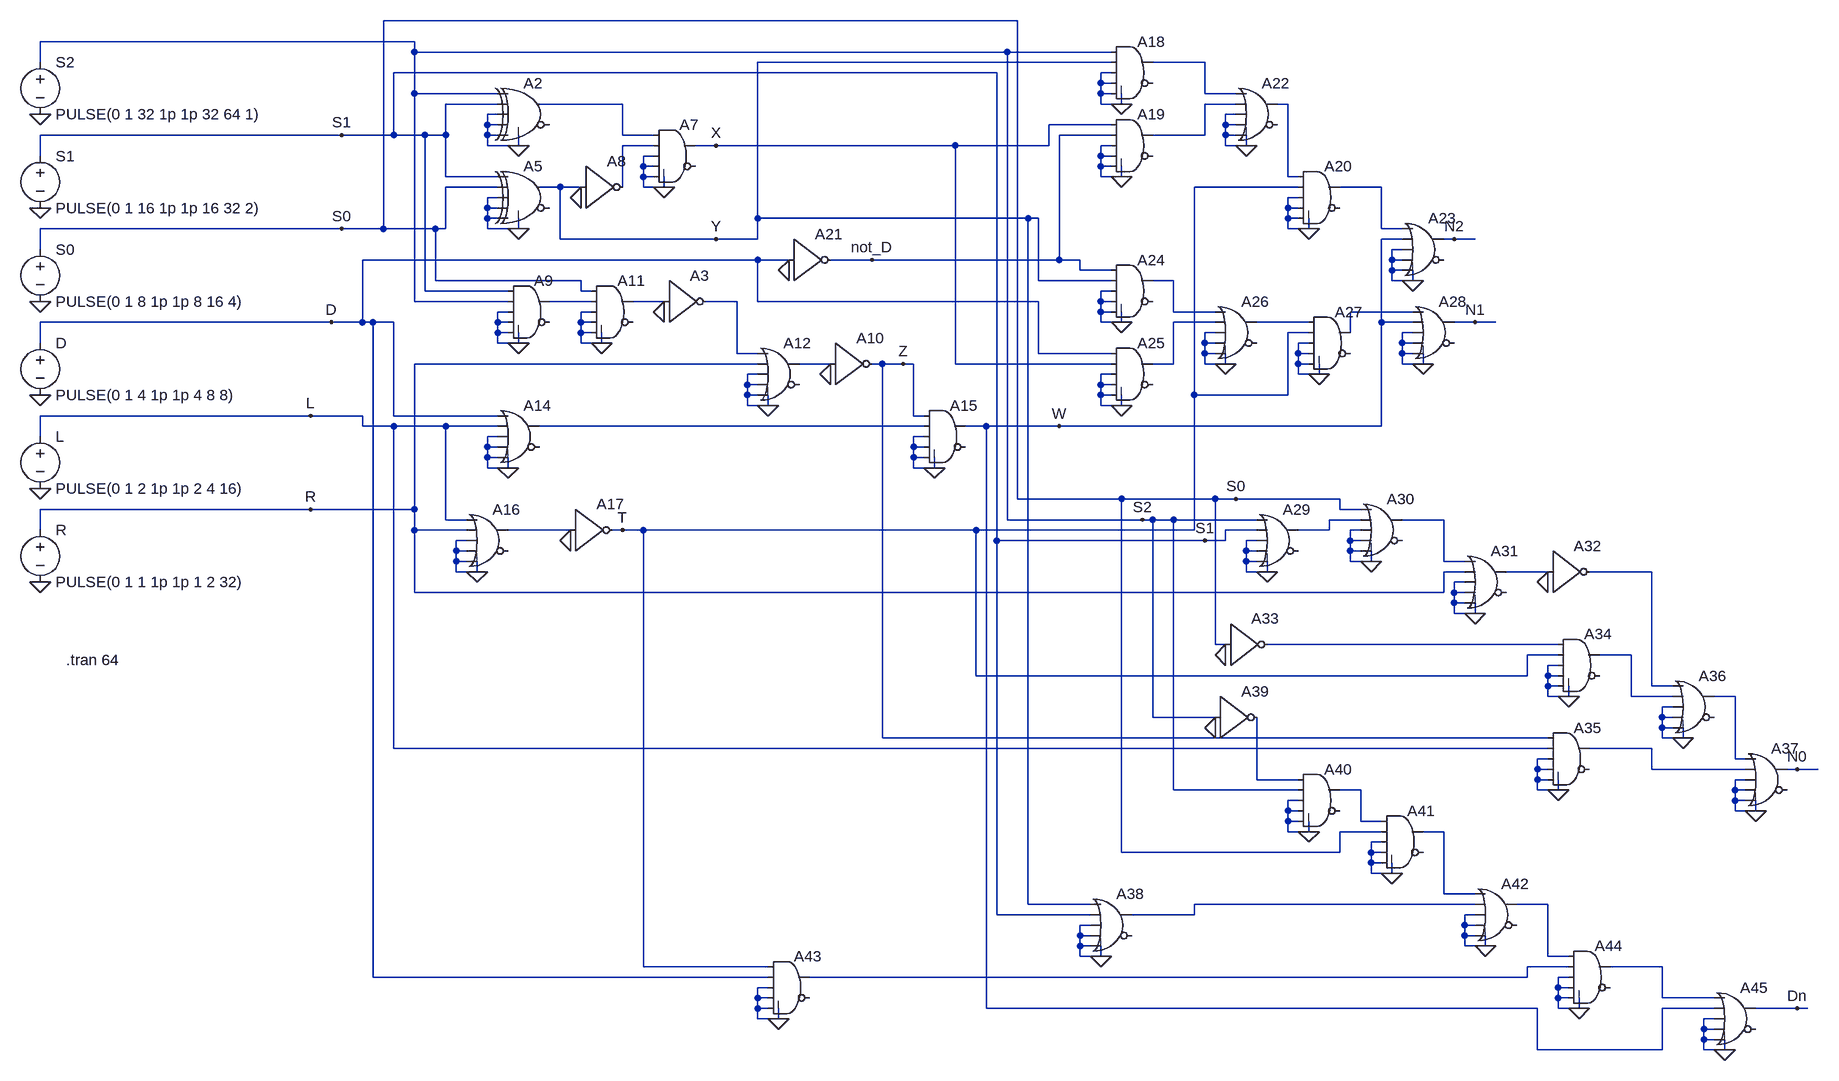
[diagram p0: schematic lab3_spice.asc]
lab3_spice.asc, the LTspice schematic file:
Version 4.1
SHEET 1 2180 1396
WIRE 944 -208 -32 -208
WIRE 16 -176 -560 -176
WIRE 16 -160 16 -176
WIRE 928 -160 16 -160
WIRE 1088 -160 928 -160
WIRE -560 -144 -560 -176
WIRE 1088 -144 544 -144
WIRE 1232 -144 1152 -144
WIRE 912 -128 -16 -128
WIRE 1088 -128 1072 -128
WIRE 1072 -112 1072 -128
WIRE 1088 -112 1072 -112
WIRE 16 -96 16 -160
WIRE 144 -96 16 -96
WIRE 1072 -96 1072 -112
WIRE 1088 -96 1072 -96
WIRE 1232 -96 1232 -144
WIRE 1280 -96 1232 -96
WIRE 144 -80 64 -80
WIRE 336 -80 208 -80
WIRE 1072 -80 1072 -96
WIRE 1104 -80 1104 -96
WIRE 1104 -80 1072 -80
WIRE 1280 -80 1232 -80
WIRE 1360 -80 1344 -80
WIRE 144 -64 128 -64
WIRE 1280 -64 1264 -64
WIRE 128 -48 128 -64
WIRE 144 -48 128 -48
WIRE 1088 -48 992 -48
WIRE 1264 -48 1264 -64
WIRE 1280 -48 1264 -48
WIRE -96 -32 -560 -32
WIRE -16 -32 -16 -128
WIRE -16 -32 -96 -32
WIRE 32 -32 -16 -32
WIRE 64 -32 64 -80
WIRE 64 -32 32 -32
WIRE 128 -32 128 -48
WIRE 144 -32 128 -32
WIRE 336 -32 336 -80
WIRE 384 -32 336 -32
WIRE 1088 -32 1008 -32
WIRE 1232 -32 1232 -80
WIRE 1232 -32 1152 -32
WIRE 1264 -32 1264 -48
WIRE 1280 -32 1264 -32
WIRE 128 -16 128 -32
WIRE 176 -16 176 -32
WIRE 176 -16 128 -16
WIRE 384 -16 336 -16
WIRE 480 -16 448 -16
WIRE 848 -16 480 -16
WIRE 992 -16 992 -48
WIRE 992 -16 848 -16
WIRE 1088 -16 1072 -16
WIRE 1264 -16 1264 -32
WIRE 1296 -16 1296 -32
WIRE 1296 -16 1264 -16
WIRE -560 0 -560 -32
WIRE 384 0 368 0
WIRE 1072 0 1072 -16
WIRE 1088 0 1072 0
WIRE 368 16 368 0
WIRE 384 16 368 16
WIRE 1072 16 1072 0
WIRE 1088 16 1072 16
WIRE 64 32 64 -32
WIRE 144 32 64 32
WIRE 368 32 368 16
WIRE 384 32 368 32
WIRE 1072 32 1072 16
WIRE 1104 32 1104 16
WIRE 1104 32 1072 32
WIRE 1360 32 1360 -80
WIRE 1376 32 1360 32
WIRE 144 48 64 48
WIRE 240 48 208 48
WIRE 272 48 240 48
WIRE 336 48 336 -16
WIRE 368 48 368 32
WIRE 400 48 400 32
WIRE 400 48 368 48
WIRE 1376 48 1216 48
WIRE 1504 48 1440 48
WIRE 144 64 128 64
WIRE 1376 64 1360 64
WIRE 128 80 128 64
WIRE 144 80 128 80
WIRE 1360 80 1360 64
WIRE 1376 80 1360 80
WIRE 128 96 128 80
WIRE 144 96 128 96
WIRE 544 96 544 -144
WIRE 960 96 544 96
WIRE 976 96 960 96
WIRE 1360 96 1360 80
WIRE 1376 96 1360 96
WIRE -96 112 -560 112
WIRE -32 112 -32 -208
WIRE -32 112 -96 112
WIRE 48 112 -32 112
WIRE 64 112 64 48
WIRE 64 112 48 112
WIRE 128 112 128 96
WIRE 176 112 176 96
WIRE 176 112 128 112
WIRE 1360 112 1360 96
WIRE 1392 112 1392 96
WIRE 1392 112 1360 112
WIRE 1504 112 1504 48
WIRE 1536 112 1504 112
WIRE 240 128 240 48
WIRE 480 128 240 128
WIRE 544 128 544 96
WIRE 544 128 480 128
WIRE 1536 128 1504 128
WIRE 1616 128 1600 128
WIRE 1648 128 1616 128
WIRE -560 144 -560 112
WIRE 1536 144 1520 144
WIRE 544 160 -64 160
WIRE 592 160 544 160
WIRE 720 160 656 160
WIRE 1008 160 1008 -32
WIRE 1008 160 720 160
WIRE 1040 160 1008 160
WIRE 1520 160 1520 144
WIRE 1536 160 1520 160
WIRE 1040 176 1040 160
WIRE 1088 176 1040 176
WIRE 1520 176 1520 160
WIRE 1536 176 1520 176
WIRE 48 192 48 112
WIRE 272 192 48 192
WIRE 976 192 976 96
WIRE 1088 192 976 192
WIRE 1184 192 1152 192
WIRE 1520 192 1520 176
WIRE 1552 192 1552 176
WIRE 1552 192 1520 192
WIRE 32 208 32 -32
WIRE 160 208 32 208
WIRE 272 208 272 192
WIRE 288 208 272 208
WIRE 1088 208 1072 208
WIRE 16 224 16 -96
WIRE 160 224 16 224
WIRE 288 224 224 224
WIRE 400 224 352 224
WIRE 512 224 464 224
WIRE 544 224 544 160
WIRE 976 224 544 224
WIRE 1072 224 1072 208
WIRE 1088 224 1072 224
WIRE 160 240 144 240
WIRE 288 240 272 240
WIRE 1072 240 1072 224
WIRE 1088 240 1072 240
WIRE 1184 240 1184 192
WIRE 1248 240 1184 240
WIRE 1552 240 1456 240
WIRE -112 256 -560 256
WIRE -64 256 -64 160
WIRE -64 256 -112 256
WIRE -48 256 -64 256
WIRE -16 256 -48 256
WIRE 144 256 144 240
WIRE 160 256 144 256
WIRE 272 256 272 240
WIRE 288 256 272 256
WIRE 1072 256 1072 240
WIRE 1104 256 1104 240
WIRE 1104 256 1072 256
WIRE 1248 256 1184 256
WIRE 1392 256 1312 256
WIRE 1504 256 1504 128
WIRE 1552 256 1504 256
WIRE 1648 256 1616 256
WIRE 1680 256 1648 256
WIRE 144 272 144 256
WIRE 160 272 144 272
WIRE 272 272 272 256
WIRE 288 272 272 272
WIRE 1248 272 1232 272
WIRE 1392 272 1360 272
WIRE 1456 272 1456 240
WIRE 1552 272 1536 272
WIRE -560 288 -560 256
WIRE 144 288 144 272
WIRE 176 288 176 272
WIRE 176 288 144 288
WIRE 272 288 272 272
WIRE 304 288 304 272
WIRE 304 288 272 288
WIRE 1232 288 1232 272
WIRE 1248 288 1232 288
WIRE 1392 288 1376 288
WIRE 1536 288 1536 272
WIRE 1552 288 1536 288
WIRE 512 304 512 224
WIRE 544 304 512 304
WIRE 976 304 976 224
WIRE 1088 304 976 304
WIRE 1232 304 1232 288
WIRE 1248 304 1232 304
WIRE 1376 304 1376 288
WIRE 1392 304 1376 304
WIRE 1536 304 1536 288
WIRE 1552 304 1536 304
WIRE 544 320 16 320
WIRE 656 320 608 320
WIRE 736 320 720 320
WIRE 768 320 736 320
WIRE 784 320 768 320
WIRE 848 320 848 -16
WIRE 1088 320 848 320
WIRE 1184 320 1184 256
WIRE 1184 320 1152 320
WIRE 1232 320 1232 304
WIRE 1264 320 1264 304
WIRE 1264 320 1232 320
WIRE 1376 320 1376 304
WIRE 1392 320 1376 320
WIRE 1536 320 1536 304
WIRE 1568 320 1568 304
WIRE 1568 320 1536 320
WIRE 544 336 528 336
WIRE 1088 336 1072 336
WIRE 1376 336 1376 320
WIRE 1408 336 1408 320
WIRE 1408 336 1376 336
WIRE 528 352 528 336
WIRE 544 352 528 352
WIRE 1072 352 1072 336
WIRE 1088 352 1072 352
WIRE 528 368 528 352
WIRE 544 368 528 368
WIRE 1072 368 1072 352
WIRE 1088 368 1072 368
WIRE 1216 368 1216 48
WIRE 1360 368 1360 272
WIRE 1360 368 1216 368
WIRE 528 384 528 368
WIRE 560 384 560 368
WIRE 560 384 528 384
WIRE 1072 384 1072 368
WIRE 1104 384 1104 368
WIRE 1104 384 1072 384
WIRE -144 400 -560 400
WIRE -64 400 -144 400
WIRE -16 400 -16 256
WIRE 144 400 -16 400
WIRE 784 400 784 320
WIRE 800 400 784 400
WIRE -64 416 -64 400
WIRE -16 416 -64 416
WIRE 64 416 -16 416
WIRE 144 416 64 416
WIRE 800 416 208 416
WIRE 896 416 864 416
WIRE 1008 416 896 416
WIRE 1504 416 1504 256
WIRE 1504 416 1008 416
WIRE -560 432 -560 400
WIRE 144 432 128 432
WIRE 800 432 784 432
WIRE 128 448 128 432
WIRE 144 448 128 448
WIRE 784 448 784 432
WIRE 800 448 784 448
WIRE 128 464 128 448
WIRE 144 464 128 464
WIRE 784 464 784 448
WIRE 800 464 784 464
WIRE 128 480 128 464
WIRE 160 480 160 464
WIRE 160 480 128 480
WIRE 784 480 784 464
WIRE 816 480 816 464
WIRE 816 480 784 480
WIRE 944 528 944 -208
WIRE 1104 528 944 528
WIRE 1248 528 1104 528
WIRE 1280 528 1248 528
WIRE 1440 528 1280 528
WIRE -144 544 -560 544
WIRE 16 544 16 320
WIRE 16 544 -144 544
WIRE 1440 544 1440 528
WIRE 1472 544 1440 544
WIRE 64 560 64 416
WIRE 96 560 64 560
WIRE 928 560 928 -160
WIRE 1136 560 928 560
WIRE 1152 560 1136 560
WIRE 1184 560 1152 560
WIRE 1312 560 1184 560
WIRE 1472 560 1424 560
WIRE 1600 560 1536 560
WIRE -560 576 -560 544
WIRE 16 576 16 544
WIRE 96 576 16 576
WIRE 256 576 160 576
WIRE 336 576 320 576
WIRE 368 576 336 576
WIRE 880 576 368 576
WIRE 1216 576 1216 368
WIRE 1216 576 880 576
WIRE 1312 576 1264 576
WIRE 1424 576 1424 560
WIRE 1424 576 1376 576
WIRE 1472 576 1456 576
WIRE 96 592 80 592
WIRE 912 592 912 -128
WIRE 1232 592 912 592
WIRE 1264 592 1264 576
WIRE 1264 592 1232 592
WIRE 1312 592 1296 592
WIRE 1456 592 1456 576
WIRE 1472 592 1456 592
WIRE 80 608 80 592
WIRE 96 608 80 608
WIRE 1296 608 1296 592
WIRE 1312 608 1296 608
WIRE 1456 608 1456 592
WIRE 1472 608 1456 608
WIRE 80 624 80 608
WIRE 96 624 80 624
WIRE 1296 624 1296 608
WIRE 1312 624 1296 624
WIRE 1456 624 1456 608
WIRE 1488 624 1488 608
WIRE 1488 624 1456 624
WIRE 1600 624 1600 560
WIRE 1632 624 1600 624
WIRE 80 640 80 624
WIRE 112 640 112 624
WIRE 112 640 80 640
WIRE 1296 640 1296 624
WIRE 1328 640 1328 624
WIRE 1328 640 1296 640
WIRE 1632 640 1600 640
WIRE 1760 640 1696 640
WIRE 1920 640 1824 640
WIRE 1632 656 1616 656
WIRE 16 672 16 576
WIRE 1600 672 1600 640
WIRE 1600 672 16 672
WIRE 1616 672 1616 656
WIRE 1632 672 1616 672
WIRE 1616 688 1616 672
WIRE 1632 688 1616 688
WIRE 1616 704 1616 688
WIRE 1648 704 1648 688
WIRE 1648 704 1616 704
WIRE 1248 752 1248 528
WIRE 1264 752 1248 752
WIRE 1776 752 1328 752
WIRE 1776 768 1728 768
WIRE 1888 768 1840 768
WIRE 1776 784 1760 784
WIRE 880 800 880 576
WIRE 1728 800 1728 768
WIRE 1728 800 880 800
WIRE 1760 800 1760 784
WIRE 1776 800 1760 800
WIRE 1760 816 1760 800
WIRE 1776 816 1760 816
WIRE 1920 816 1920 640
WIRE 1952 816 1920 816
WIRE 1760 832 1760 816
WIRE 1792 832 1792 816
WIRE 1792 832 1760 832
WIRE 1888 832 1888 768
WIRE 1952 832 1888 832
WIRE 2048 832 2016 832
WIRE 1952 848 1936 848
WIRE 1152 864 1152 560
WIRE 1248 864 1152 864
WIRE 1936 864 1936 848
WIRE 1952 864 1936 864
WIRE 1936 880 1936 864
WIRE 1952 880 1936 880
WIRE 736 896 736 320
WIRE 1760 896 736 896
WIRE 1936 896 1936 880
WIRE 1968 896 1968 880
WIRE 1968 896 1936 896
WIRE -16 912 -16 416
WIRE 1760 912 -16 912
WIRE 1920 912 1824 912
WIRE 1760 928 1744 928
WIRE 2048 928 2048 832
WIRE 2064 928 2048 928
WIRE 1744 944 1744 928
WIRE 1760 944 1744 944
WIRE 1920 944 1920 912
WIRE 2064 944 1920 944
WIRE 2144 944 2128 944
WIRE 2176 944 2144 944
WIRE 1312 960 1312 864
WIRE 1376 960 1312 960
WIRE 1744 960 1744 944
WIRE 1760 960 1744 960
WIRE 2064 960 2048 960
WIRE 1184 976 1184 560
WIRE 1376 976 1184 976
WIRE 1472 976 1440 976
WIRE 1744 976 1744 960
WIRE 1776 976 1776 960
WIRE 1776 976 1744 976
WIRE 2048 976 2048 960
WIRE 2064 976 2048 976
WIRE 1376 992 1360 992
WIRE 2048 992 2048 976
WIRE 2064 992 2048 992
WIRE 1360 1008 1360 992
WIRE 1376 1008 1360 1008
WIRE 2048 1008 2048 992
WIRE 2080 1008 2080 992
WIRE 2080 1008 2048 1008
WIRE 1360 1024 1360 1008
WIRE 1376 1024 1360 1024
WIRE 1472 1024 1472 976
WIRE 1504 1024 1472 1024
WIRE 1360 1040 1360 1024
WIRE 1392 1040 1392 1024
WIRE 1392 1040 1360 1040
WIRE 1504 1040 1440 1040
WIRE 1600 1040 1568 1040
WIRE 1504 1056 1488 1056
WIRE 1104 1072 1104 528
WIRE 1440 1072 1440 1040
WIRE 1440 1072 1104 1072
WIRE 1488 1072 1488 1056
WIRE 1504 1072 1488 1072
WIRE 1488 1088 1488 1072
WIRE 1504 1088 1488 1088
WIRE 1488 1104 1488 1088
WIRE 1520 1104 1520 1088
WIRE 1520 1104 1488 1104
WIRE 1600 1136 1600 1040
WIRE 1648 1136 1600 1136
WIRE 960 1152 960 96
WIRE 1056 1152 960 1152
WIRE 1648 1152 1216 1152
WIRE 1760 1152 1712 1152
WIRE 912 1168 912 592
WIRE 1056 1168 912 1168
WIRE 1216 1168 1216 1152
WIRE 1216 1168 1120 1168
WIRE 1648 1168 1632 1168
WIRE 1056 1184 1040 1184
WIRE 1632 1184 1632 1168
WIRE 1648 1184 1632 1184
WIRE 1040 1200 1040 1184
WIRE 1056 1200 1040 1200
WIRE 1632 1200 1632 1184
WIRE 1648 1200 1632 1200
WIRE 1040 1216 1040 1200
WIRE 1056 1216 1040 1216
WIRE 1632 1216 1632 1200
WIRE 1664 1216 1664 1200
WIRE 1664 1216 1632 1216
WIRE 1040 1232 1040 1216
WIRE 1072 1232 1072 1216
WIRE 1072 1232 1040 1232
WIRE 1760 1232 1760 1152
WIRE 1792 1232 1760 1232
WIRE 368 1248 368 576
WIRE 560 1248 368 1248
WIRE 1792 1248 1728 1248
WIRE 1936 1248 1856 1248
WIRE -48 1264 -48 256
WIRE 560 1264 -48 1264
WIRE 1728 1264 1728 1248
WIRE 1728 1264 624 1264
WIRE 1792 1264 1776 1264
WIRE 560 1280 544 1280
WIRE 1776 1280 1776 1264
WIRE 1792 1280 1776 1280
WIRE 544 1296 544 1280
WIRE 560 1296 544 1296
WIRE 1776 1296 1776 1280
WIRE 1792 1296 1776 1296
WIRE 1936 1296 1936 1248
WIRE 2016 1296 1936 1296
WIRE 544 1312 544 1296
WIRE 560 1312 544 1312
WIRE 896 1312 896 416
WIRE 1744 1312 896 1312
WIRE 1776 1312 1776 1296
WIRE 1808 1312 1808 1296
WIRE 1808 1312 1776 1312
WIRE 2016 1312 1936 1312
WIRE 2144 1312 2080 1312
WIRE 2160 1312 2144 1312
WIRE 544 1328 544 1312
WIRE 576 1328 576 1312
WIRE 576 1328 544 1328
WIRE 2016 1328 2000 1328
WIRE 2000 1344 2000 1328
WIRE 2016 1344 2000 1344
WIRE 2000 1360 2000 1344
WIRE 2016 1360 2000 1360
WIRE 1744 1376 1744 1312
WIRE 1936 1376 1936 1312
WIRE 1936 1376 1744 1376
WIRE 2000 1376 2000 1360
WIRE 2032 1376 2032 1360
WIRE 2032 1376 2000 1376
FLAG -560 224 0
FLAG 176 -16 0
FLAG 400 240 0
FLAG 176 112 0
FLAG -560 80 0
FLAG -560 -64 0
FLAG -560 368 0
FLAG -560 512 0
FLAG -560 656 0
FLAG 400 48 0
FLAG 272 64 0
FLAG 176 288 0
FLAG 304 288 0
FLAG 560 384 0
FLAG 656 336 0
FLAG 160 480 0
FLAG 816 480 0
FLAG 112 640 0
FLAG 256 592 0
FLAG 336 576 T
FLAG 1008 416 W
FLAG 768 320 Z
FLAG 480 128 Y
FLAG 480 -16 X
FLAG 1104 -80 0
FLAG 1104 32 0
FLAG 1392 112 0
FLAG 592 176 0
FLAG 1296 -16 0
FLAG 1552 192 0
FLAG 1616 128 N2
FLAG 1104 256 0
FLAG 1104 384 0
FLAG 720 160 not_D
FLAG 1264 320 0
FLAG 1408 336 0
FLAG 1568 320 0
FLAG 1648 256 N1
FLAG 1328 640 0
FLAG 1488 624 0
FLAG 1648 704 0
FLAG 1760 656 0
FLAG 1280 528 S0
FLAG 1792 832 0
FLAG 1776 976 0
FLAG 1968 896 0
FLAG 2080 1008 0
FLAG 2144 944 N0
FLAG 1136 560 S2
FLAG 1232 592 S1
FLAG 1072 1232 0
FLAG 1264 768 0
FLAG 1392 1040 0
FLAG 1248 880 0
FLAG 1520 1104 0
FLAG 1664 1216 0
FLAG 576 1328 0
FLAG 1808 1312 0
FLAG 2032 1376 0
FLAG 2144 1312 Dn
FLAG -144 544 R
FLAG -144 400 L
FLAG -96 112 S0
FLAG -112 256 D
FLAG -96 -32 S1
SYMBOL voltage -560 128 R0
SYMATTR InstName S0
SYMATTR Value PULSE(0 1 8 1p 1p 8 16 4)
SYMBOL Digital\\xor 192 -128 R0
SYMATTR InstName A2
SYMBOL Digital\\inv 400 160 R0
SYMATTR InstName A3
SYMBOL Digital\\xor 192 0 R0
SYMATTR InstName A5
SYMBOL voltage -560 -16 R0
SYMATTR InstName S1
SYMATTR Value PULSE(0 1 16 1p 1p 16 32 2)
SYMBOL voltage -560 -160 R0
SYMATTR InstName S2
SYMATTR Value PULSE(0 1 32 1p 1p 32 64 1)
SYMBOL voltage -560 272 R0
SYMATTR InstName D
SYMATTR Value PULSE(0 1 4 1p 1p 4 8 8)
SYMBOL voltage -560 416 R0
SYMATTR InstName L
SYMATTR Value PULSE(0 1 2 1p 1p 2 4 16)
SYMBOL voltage -560 560 R0
SYMATTR InstName R
SYMATTR Value PULSE(0 1 1 1p 1p 1 2 32)
SYMBOL Digital\\and 416 -64 R0
SYMATTR InstName A7
SYMBOL Digital\\inv 272 -16 R0
SYMATTR InstName A8
SYMBOL Digital\\and 192 176 R0
SYMATTR InstName A9
SYMBOL Digital\\and 320 176 R0
SYMATTR InstName A11
SYMBOL Digital\\or 576 272 R0
SYMATTR InstName A12
SYMBOL Digital\\inv 656 256 R0
SYMATTR InstName A10
SYMBOL Digital\\or 176 368 R0
SYMATTR InstName A14
SYMBOL Digital\\and 832 368 R0
SYMATTR InstName A15
SYMBOL Digital\\or 128 528 R0
SYMATTR InstName A16
SYMBOL Digital\\inv 256 512 R0
SYMATTR InstName A17
SYMBOL Digital\\and 1120 -192 R0
SYMATTR InstName A18
SYMBOL Digital\\and 1120 -80 R0
SYMATTR InstName A19
SYMBOL Digital\\and 1408 0 R0
SYMATTR InstName A20
SYMBOL Digital\\inv 592 96 R0
SYMATTR InstName A21
SYMBOL Digital\\or 1312 -128 R0
SYMATTR InstName A22
SYMBOL Digital\\or 1568 80 R0
SYMATTR InstName A23
SYMBOL Digital\\and 1120 144 R0
SYMATTR InstName A24
SYMBOL Digital\\and 1120 272 R0
SYMATTR InstName A25
SYMBOL Digital\\or 1280 208 R0
SYMATTR InstName A26
SYMBOL Digital\\and 1424 224 R0
SYMATTR InstName A27
SYMBOL Digital\\or 1584 208 R0
SYMATTR InstName A28
SYMBOL Digital\\or 1344 528 R0
SYMATTR InstName A29
SYMBOL Digital\\or 1504 512 R0
SYMATTR InstName A30
SYMBOL Digital\\or 1664 592 R0
SYMATTR InstName A31
SYMBOL Digital\\inv 1760 576 R0
SYMATTR InstName A32
SYMBOL Digital\\and 1808 720 R0
SYMATTR InstName A34
SYMBOL Digital\\and 1792 864 R0
SYMATTR InstName A35
SYMBOL Digital\\or 1984 784 R0
SYMATTR InstName A36
SYMBOL Digital\\or 2096 896 R0
SYMATTR InstName A37
SYMBOL Digital\\or 1088 1120 R0
SYMATTR InstName A38
SYMBOL Digital\\inv 1264 688 R0
SYMATTR InstName A33
SYMBOL Digital\\and 1408 928 R0
SYMATTR InstName A40
SYMBOL Digital\\inv 1248 800 R0
SYMATTR InstName A39
SYMBOL Digital\\and 1536 992 R0
SYMATTR InstName A41
SYMBOL Digital\\or 1680 1104 R0
SYMATTR InstName A42
SYMBOL Digital\\and 592 1216 R0
SYMATTR InstName A43
SYMBOL Digital\\and 1824 1200 R0
SYMATTR InstName A44
SYMBOL Digital\\or 2048 1264 R0
SYMATTR InstName A45
TEXT -520 776 Left 2 !.tran 64

The netlist it stands for:
* lab3_spice.asc
V§S0 S0 0 PULSE(0 1 8 1p 1p 8 16 4)
A2 S2 S1 0 0 0 0 N002 0 XOR
A3 N009 0 0 0 0 N010 0 0 BUF
A5 S1 S0 0 0 0 0 Y 0 XOR
V§S1 S1 0 PULSE(0 1 16 1p 1p 16 32 2)
V§S2 S2 0 PULSE(0 1 32 1p 1p 32 64 1)
V§D D 0 PULSE(0 1 4 1p 1p 4 8 8)
V§L L 0 PULSE(0 1 2 1p 1p 2 4 16)
V§R R 0 PULSE(0 1 1 1p 1p 1 2 32)
A7 N002 N005 0 0 0 0 X 0 AND
A8 Y 0 0 0 0 N005 0 0 BUF
A9 S1 S2 0 0 0 0 N008 0 AND
A11 S0 N008 0 0 0 0 N009 0 AND
A12 N010 R 0 0 0 0 N014 0 OR
A10 N014 0 0 0 0 Z 0 0 BUF
A14 D L 0 0 0 0 N015 0 OR
A15 Z N015 0 0 0 0 W 0 AND
A16 L R 0 0 0 0 N018 0 OR
A17 N018 0 0 0 0 T 0 0 BUF
A18 S2 Y 0 0 0 0 N001 0 AND
A19 X not_D 0 0 0 0 N003 0 AND
A20 N004 T 0 0 0 0 N006 0 AND
A21 D 0 0 0 0 not_D 0 0 BUF
A22 N001 N003 0 0 0 0 N004 0 OR
A23 N006 W 0 0 0 0 N2 0 OR
A24 not_D Y 0 0 0 0 N007 0 AND
A25 D X 0 0 0 0 N012 0 AND
A26 N007 N012 0 0 0 0 N013 0 OR
A27 N013 T 0 0 0 0 N011 0 AND
A28 N011 W 0 0 0 0 N1 0 OR
A29 S2 S1 0 0 0 0 N016 0 OR
A30 S0 N016 0 0 0 0 N017 0 OR
A31 N017 R 0 0 0 0 N019 0 OR
A32 N019 0 0 0 0 N020 0 0 BUF
A34 N021 T 0 0 0 0 N022 0 AND
A35 Z L 0 0 0 0 N024 0 AND
A36 N020 N022 0 0 0 0 N023 0 OR
A37 N023 N024 0 0 0 0 N0 0 OR
A38 Y S1 0 0 0 0 N028 0 OR
A33 S0 0 0 0 0 N021 0 0 BUF
A40 N025 S2 0 0 0 0 N026 0 AND
A39 S2 0 0 0 0 N025 0 0 BUF
A41 N026 S0 0 0 0 0 N027 0 AND
A42 N027 N028 0 0 0 0 N029 0 OR
A43 T D 0 0 0 0 N030 0 AND
A44 N029 N030 0 0 0 0 N031 0 AND
A45 N031 W 0 0 0 0 Dn 0 OR
.tran 64
.backanno
.end